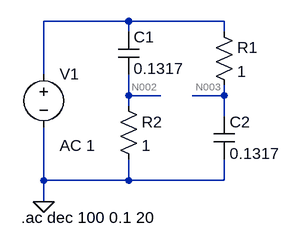
[diagram p0: schematic Draft2.asc]
Draft2.asc, the LTspice schematic file:
Version 4
SHEET 1 880 680
WIRE 144 80 16 80
WIRE 288 80 144 80
WIRE 144 96 144 80
WIRE 288 96 288 80
WIRE 16 160 16 80
WIRE 144 192 144 160
WIRE 192 192 144 192
WIRE 288 192 288 176
WIRE 288 192 240 192
WIRE 144 208 144 192
WIRE 288 224 288 192
WIRE 16 320 16 240
WIRE 144 320 144 288
WIRE 144 320 16 320
WIRE 288 320 288 288
WIRE 288 320 144 320
WIRE 16 352 16 320
FLAG 16 352 0
SYMBOL cap 128 96 R0
SYMATTR InstName C1
SYMATTR Value 0.1317
SYMBOL cap 272 224 R0
SYMATTR InstName C2
SYMATTR Value 0.1317
SYMBOL res 272 80 R0
SYMATTR InstName R1
SYMATTR Value 1
SYMBOL res 128 192 R0
SYMATTR InstName R2
SYMATTR Value 1
SYMBOL voltage 16 144 R0
WINDOW 123 24 124 Left 2
WINDOW 39 0 0 Left 0
SYMATTR InstName V1
SYMATTR Value ""
SYMATTR Value2 AC 1
TEXT -18 376 Left 2 !.ac dec 100 0.1 20

The netlist it stands for:
* Draft2.asc
C1 N001 N002 0.1317
C2 N003 0 0.1317
R1 N001 N003 1
R2 N002 0 1
V1 N001 0 AC 1
.ac dec 100 0.1 20
.backanno
.end

* Results of the author's LTspice run, read from the files saved beside the schematic
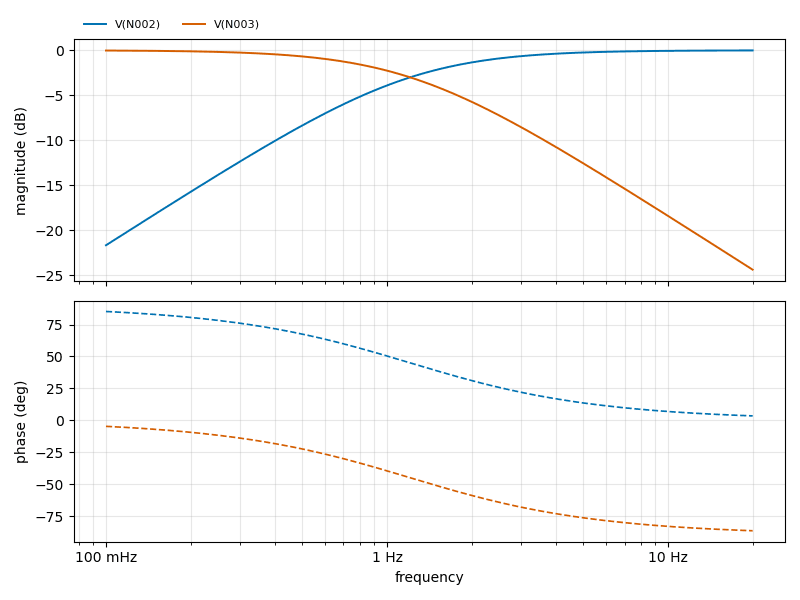
[diagram p1: AC Analysis of Draft2.asc, plotted from the saved traces]
* AC Analysis, 1 run:
*   V(N002): -21.67 dB at 100 mHz, -0.02 dB at 20 Hz, peak -0.02 dB at 20 Hz, 3 dB below the peak at 1.204 Hz
*   V(N003): -0.03 dB at 100 mHz, -24.39 dB at 20 Hz, peak -0.03 dB at 100 mHz, 3 dB below the peak at 1.217 Hz